# EAGLE design tx-audio breakout (EAGLE 6.2)
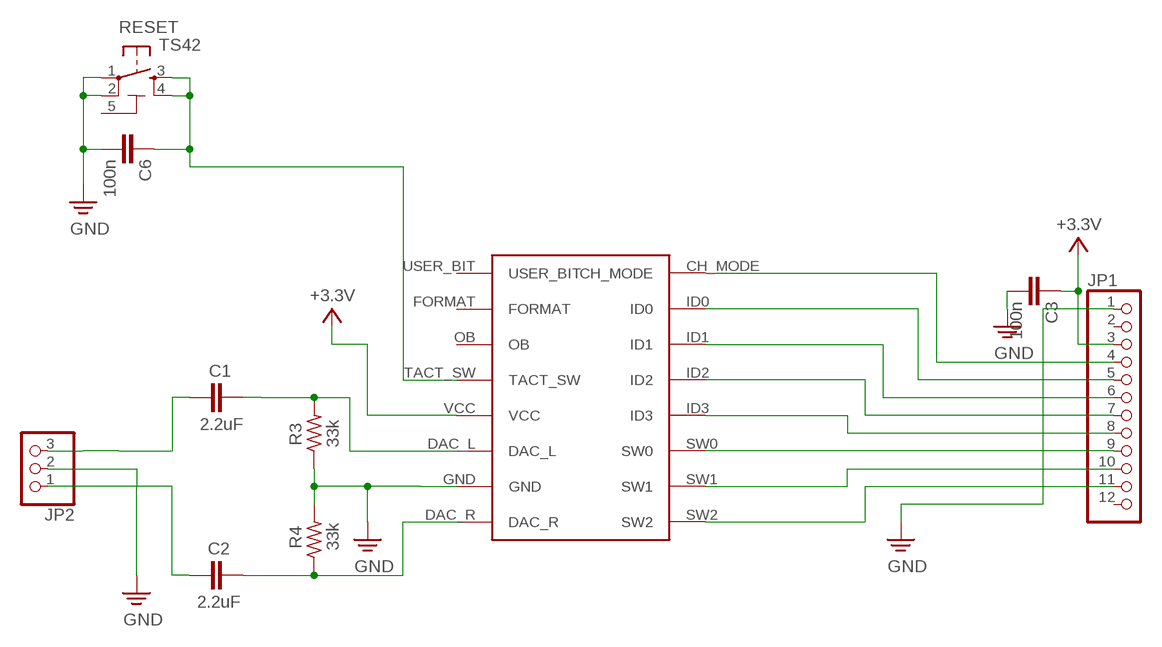
[diagram p0: schematic, sheet 1]

## Parts
C1  2.2uF  CAPACITOR0805  [0805A]
C2  2.2uF  CAPACITOR0805  [0805A]
C3  100n  C-EUC0805  [C0805]
C6  100n  C-EUC0805  [C0805]
JP1  PINHD-1X12  [1X12]
JP2  PINHD-1X3  [1X03]
R3  33k  RESISTOR0805  [0805A]
R4  33k  RESISTOR0805  [0805A]
RESET  TS42  [TS42]
U$1  TX-AUDIO-2.4VERTICAL  [AUREL-TX-AUDIO-2.4GH-TRH]

## Nets
GND: C3.2 C6.2 JP1.1 JP2.2 R3.+ R4.- RESET.1 RESET.2 U$1.GND
LINE_IN: C1.+ JP2.3
N2 [gnd]: C6.1 RESET.3 RESET.4 U$1.TACT_SW
N$1: JP1.10 U$1.SW1
N$2: JP1.11 U$1.SW2
N$3: JP1.9 U$1.SW0
N$4: C1.- R3.- U$1.DAC_L
N$5: JP1.8 U$1.ID3
N$6: JP1.7 U$1.ID2
N$7: JP1.6 U$1.ID1
N$8: JP1.5 U$1.ID0
N$9: JP1.4 U$1.CH_MODE
N$16: C2.- JP2.1
N$17: C2.+ R4.+ U$1.DAC_R
VCC: C3.1 JP1.3 U$1.VCC ; supply symbol labelled +3.3V
Unconnected: JP1.2 JP1.12 U$1.FORMAT U$1.OB U$1.USER_BIT

## Power pins joined to a net without a drawn wire
5-GND: RESET.5(5-GND)

## Library data of the parts
C1 C2 = audioint:CAPACITOR
C3 C6 = SmartPrj:C-EU: CAPACITOR, European symbol
JP1 = pinhead:PINHD-1X12: PIN HEADER
JP2 = pinhead:PINHD-1X3: PIN HEADER
R3 R4 = audioint:RESISTOR
RESET = SmartPrj:TS42: TS42 Dongnan Electronics Tact switch VDC 12V - 50mA
U$1 = aurel:TX-AUDIO-2.4: MODULE, TRANSMITTER, 2.4GHZ, AUDIO Development Tool Type: Hardware - Module Kit Features: 2.4GHz Digital Audio Signal Transmitter, 10dBm Transmit Power Tool / Board Application: Digital Audio Transmitter Type: Digital Audio Transmitter farnell.com <http://ro.farnell.com/aurel/tx-audio-2-4-ae/module-transmitter-2-4ghz-audio/dp/1699492?in_merch=true&MER=i-9b10-00001460>

## Net classes
2 gnd: width 0.254 mm, drill 0.61 mm, clearance 0.254 mm

## Board
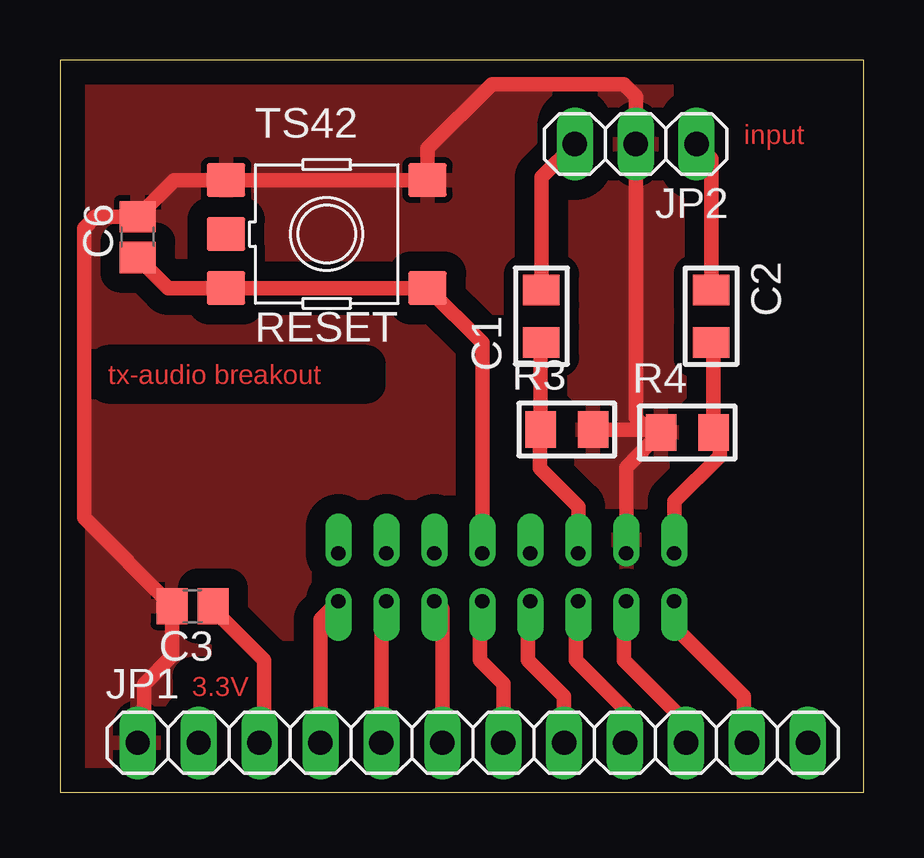
[diagram p1: board, top side]
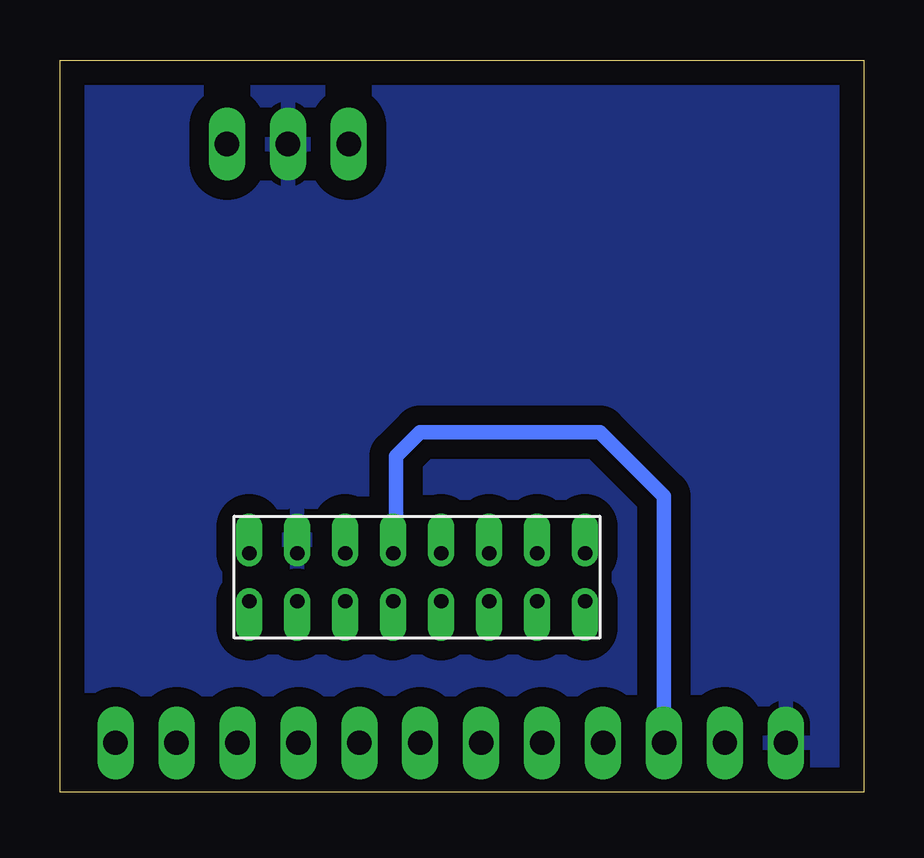
[diagram p2: board, bottom side, seen from below]

Size 33.5 x 30.5 mm. Coordinates in mm from the lower left corner, seen from the top.
Outline: 0,0 33.5,0 33.5,30.5 0,30.5 0,0
Copper layers (1*16): Top 0.035mm / dielectric 1.5mm / Bottom 0.035mm
Design rules: minimum track width 10mil, minimum drill 24mil, track to track 8mil, track to pad 8mil, pad to pad 8mil, via to via 8mil, smd to smd 8mil, copper to edge 40mil, drill to drill 8mil, minimum pad ring 10mil, minimum via ring 8mil, stop-mask expansion 4mil, vias tented up to drill 0mil, thermal gap 10mil

### Footprints (pad centres in the part's own frame; a part is rotated, then mirrored left to right if it is on the bottom)
0805A = smd 1.27 x 1.524: + 1.091,0; - -1.091,0
C0805 = smd 1.3 x 1.5: 1 -0.85,0; 2 0.85,0
1X12 = drill 1.016 long: 1 -13.97,0; 2 -11.43,0; 3 -8.89,0; 4 -6.35,0; 5 -3.81,0; 6 -1.27,0; 7 1.27,0; 8 3.81,0; 9 6.35,0; 10 8.89,0; 11 11.43,0; 12 13.97,0
1X03 = drill 1.016 long: 1 -2.54,0; 2 0,0; 3 2.54,0
TS42 = smd 1.6 x 1.4: 1 -4.2,2.25; 2 4.2,2.25; 3 -4.2,-2.25; 4 4.2,-2.25; 5 -4.2,0
AUREL-TX-AUDIO-2.4GH-TRH = drill 0.6 offset: CH_MODE 1,7; DAC_L -1,-3; DAC_R -1,-7; FORMAT -1,5; GND -1,-5; ID0 1,5; ID1 1,3; ID2 1,1; ID3 1,-1; OB -1,3; SW0 1,-3; SW1 1,-5; SW2 1,-7; TACT_SW -1,1; USER_BIT -1,7; VCC -1,-1

### Placement (x,y rotation side)
C1  20.07,19.83 90 top
C2  27.15,19.83 270 top
C3  5.53,7.74 180 top
C6  3.24,23.12 90 top
JP1  17.21,2.05 0 top
JP2  24,27 180 top
R3  21.13,15.1 0 top
R4  26.15,14.98 0 top
RESET  11.12,23.25 0 top
U$1  18.61,8.95 270 bottom

### Tracks (layer width: path | path; a pad name or v marks a point on that pad's centre or on a via)
GND
  Top 0.61: R3.+ 24.5,15.1 | 24.5,15.1 24.94,15.1 R4.- 23.61,13.53 U$1.GND | 24.5,15.1 24,15.6 JP2.2 24,29 23.5,29.5 18,29.5 15.32,26.82 RESET.2 RESET.1 4.77,25.5 C6.2 1.47,23.97 1,23.5 1,11.42 C3.2 4.68,5.68 3.5,4.5 3.5,2.31 JP1.1
  pour Top (isolate 0.813): 0,30 33.5,29.5 33.5,-0.5 0,0
  pour Bottom (isolate 0.813): 0,30 33.5,29.5 33.5,-0.5 0,0
LINE_IN
  Top 0.61: C1.+ 20.07,25.61 JP2.3
N2
  Top 0.61: U$1.TACT_SW 17.61,18.71 RESET.4 RESET.3 4.51,21 C6.1
N$1
  Top 0.61: JP1.10 26.1,2.9 23.5,5.5 23.5,7.84 U$1.SW1
N$2
  Top 0.61: U$1.SW2 25.61,6.89 28.5,4 28.5,2.19 JP1.11
N$3
  Top 0.61: JP1.9 23.56,3.44 21.5,5.5 21.5,7.84 U$1.SW0
N$4
  Top 0.61: U$1.DAC_L 21.61,11.89 20,13.5 20,15.06 R3.- 20.04,18.71 C1.-
N$5
  Top 0.61: JP1.8 21.02,3.98 19.5,5.5 19.5,7.84 U$1.ID3
N$6
  Top 0.61: JP1.7 18.48,4.52 17.5,5.5 17.5,7.84 U$1.ID2
N$7
  Top 0.61: JP1.6 15.94,7.62 U$1.ID1
N$8
  Top 0.61: JP1.5 13.4,7.74 U$1.ID0
N$9
  Top 0.61: JP1.4 10.86,7.2 U$1.CH_MODE
N$16
  Top 0.61: C2.- 27.15,26.39 JP2.1
N$17
  Top 0.61: U$1.DAC_R 25.61,12.11 27.5,14 27.5,14.72 R4.+ 27.24,18.65 C2.+
VCC
  Top 0.61: C3.1 6.38,7.62 8.5,5.5 8.5,2.23 JP1.3
  Bottom 0.61: JP1.3 8.32,12.32 11,15 18.5,15 19.5,14 19.5,10.06 U$1.VCC

### Text on the board
Top: input | tx-audio breakout | 3.3V